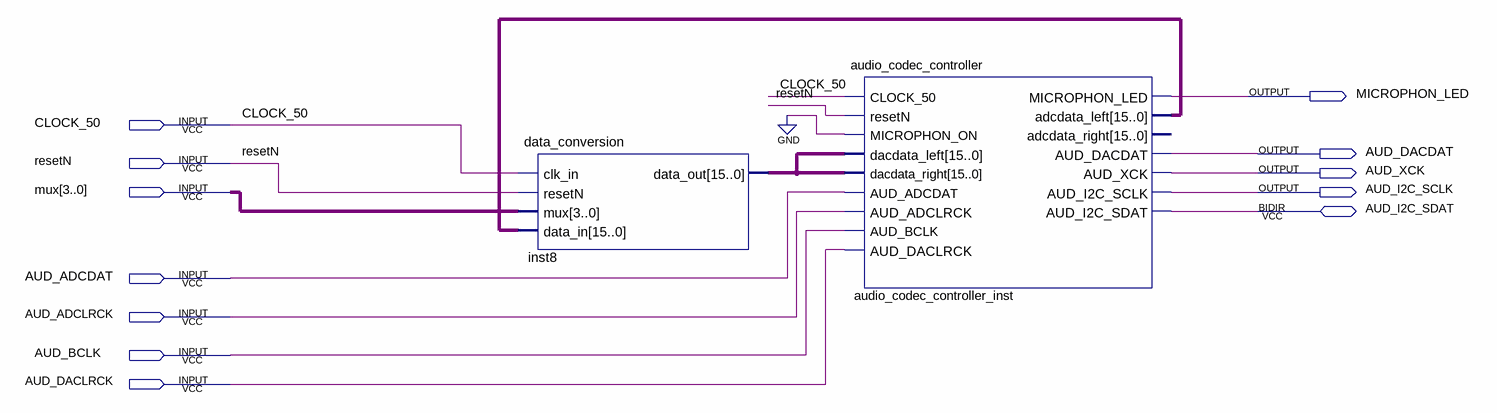
[diagram p0: schematic sheet]
// Quartus schematic experiment_data_conversion.bdf as structural Verilog: 2 symbols, 12 pins
module experiment_data_conversion (
  input  CLOCK_50,
  input  resetN,
  input  [3:0] mux,
  input  AUD_ADCDAT,
  input  AUD_ADCLRCK,
  input  AUD_BCLK,
  input  AUD_DACLRCK,
  inout  AUD_I2C_SDAT,
  output MICROPHON_LED,
  output AUD_DACDAT,
  output AUD_XCK,
  output AUD_I2C_SCLK
);

  wire [15:0] audio_codec_controller_inst_adcdata_left, inst8_data_out;

  data_conversion inst8 (
    .clk_in(CLOCK_50), .resetN(resetN), .mux(mux), .data_in(audio_codec_controller_inst_adcdata_left),
    .data_out(inst8_data_out));
  audio_codec_controller audio_codec_controller_inst (
    .CLOCK_50(CLOCK_50), .resetN(resetN), .MICROPHON_ON(1'b0), .dacdata_left(inst8_data_out),
    .dacdata_right(inst8_data_out), .AUD_ADCDAT(AUD_ADCDAT), .AUD_ADCLRCK(AUD_ADCLRCK), .AUD_BCLK(AUD_BCLK),
    .AUD_DACLRCK(AUD_DACLRCK), .MICROPHON_LED(MICROPHON_LED),
    .adcdata_left(audio_codec_controller_inst_adcdata_left), .AUD_DACDAT(AUD_DACDAT), .AUD_XCK(AUD_XCK),
    .AUD_I2C_SCLK(AUD_I2C_SCLK), .AUD_I2C_SDAT(AUD_I2C_SDAT));  // open: adcdata_right
endmodule
